# Altium schematic sheet enet_phy.SchDoc: 10/100 Copper PHY
size B; Engineer: Michael J. Kelly; Organization: CSB540otn - Outernet; Address1: AM335x Compute Board; Address2: (C) 2015; Address3: See us on the Web:; Address4: http://outernet.is; DocumentNumber: 5; Revision: V1.0; SheetNumber: 5; SheetTotal: 9
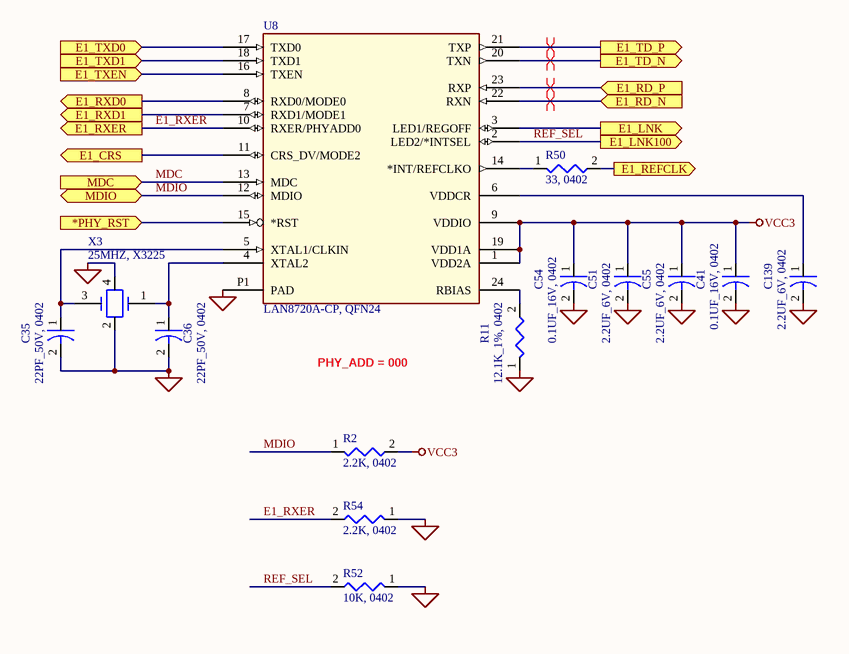
[diagram p0: enet_phy.SchDoc]

## Parts
C35  22PF_50V, 0402  [0402C]
C36  22PF_50V, 0402  [0402C]
C41  0.1UF_16V, 0402  [0402C]
C51  2.2UF_6V, 0402  [0402C]
C54  0.1UF_16V, 0402  [0402C]
C55  2.2UF_6V, 0402  [0402C]
C139  2.2UF_6V, 0402  [0402C]
R2  2.2K, 0402  [0402R]
R11  12.1K_1%, 0402  [0402R]
R50  33, 0402  [0402R]
R52  10K, 0402  [0402R]
R54  2.2K, 0402  [0402R]
U8  LAN8720A-CP, QFN24  [QFN24]
X3  25MHZ, X3225  [X3225]

## Ports
*PHY_RST (in), E1_CRS (out), E1_LNK100 (out), E1_LNK (out), E1_RD_N (in), E1_RD_P (in), E1_REFCLK (out), E1_RXD0 (out), E1_RXD1 (out), E1_RXER (out), E1_TD_N (out), E1_TD_P (out), E1_TXD0 (in), E1_TXD1 (in), E1_TXEN (in), MDC (in), MDIO (bidir)

## Nets
GND: C35.2 C36.2 C41.2 C51.2 C54.2 C55.2 C139.2 R11.1 R52.1 R54.1 U8.P1(PAD) X3.2 X3.4
VCC3: C41.1 C51.1 C54.1 C55.1 R2.2 U8.1(VDD2A) U8.9(VDDIO) U8.19(VDD1A)
*PHY_RST: U8.15(*RST) ; port *PHY_RST
E1_CRS: U8.11(CRS_DV/MODE2) ; port E1_CRS
E1_LNK: U8.3(LED1/REGOFF) ; port E1_LNK
E1_RD_N: U8.22(RXN) ; port E1_RD_N
E1_RD_P: U8.23(RXP) ; port E1_RD_P
E1_REFCLK: R50.2 ; port E1_REFCLK
E1_RXD0: U8.8(RXD0/MODE0) ; port E1_RXD0
E1_RXD1: U8.7(RXD1/MODE1) ; port E1_RXD1
E1_RXER: R54.2 U8.10(RXER/PHYADD0) ; port E1_RXER
E1_TD_N: U8.20(TXN) ; port E1_TD_N
E1_TD_P: U8.21(TXP) ; port E1_TD_P
E1_TXD0: U8.17(TXD0) ; port E1_TXD0
E1_TXD1: U8.18(TXD1) ; port E1_TXD1
E1_TXEN: U8.16(TXEN) ; port E1_TXEN
MDC: U8.13(MDC) ; port MDC
MDIO: R2.1 U8.12(MDIO) ; port MDIO
REF_SEL: R52.2 U8.2(LED2/*INTSEL) ; port E1_LNK100
NetC35_1: C35.1 U8.5(XTAL1/CLKIN) X3.3
NetC36_1: C36.1 U8.4(XTAL2) X3.1
NetC139_1: C139.1 U8.6(VDDCR)
NetR11_2: R11.2 U8.24(RBIAS)
NetR50_1: R50.1 U8.14(*INT/REFCLKO)

## Layout directives
differential pair: E1_RD_N, E1_RD_P, E1_TD_N, E1_TD_P

## Notes on the sheet
- PHY_ADD = 000
- OUTERNET INC. - LANTERN PROJECT
- Title:
- Size:
- Date:
- B
- Engineer:
- Time:
- Rev:
- Sheet
- of
- File:

## Library data of the parts
C35 C36 = 22PF_50V, 0402: CAP - 0402 PKG
C41 C54 = 0.1UF_16V, 0402: CAP - 0402 PKG
C51 C55 C139 = 2.2UF_6V, 0402: CAP - 0402 PKG
R2 R54 = 2.2K, 0402: RES - 0402 PKG
R11 = 12.1K_1%, 0402: RES - 0402 PKG
R50 = 33, 0402: RES - 0402 PKG
R52 = 10K, 0402: RES - 0402 PKG
U8 = LAN8720A-CP, QFN24: PHY - 10/100 RMII
X3 = 25MHZ, X3225: CRYSTAL - SMT, 3.2MM x 2.5MM, ABM8 PKG